# Altium project power.PrjPCB
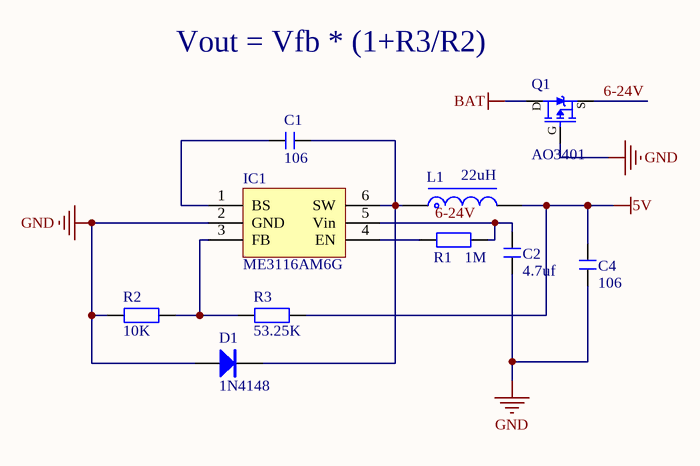
[diagram p0: power.SchDoc]
1 sheet, 10 parts. Net scope: global (net labels, ports and power ports of the same name join across sheets).
Board file: power.PcbDoc

## Sheet power.SchDoc
size A4

### Parts
C1  106  [C 0603_L]
C2  4.7uf  [C 0603_L]
C4  106  [C 0603_L]
D1  1N4148  [SOD-323]
IC1  ME3116AM6G  [SOT23-6N]
L1  22uH  [NR2520]
Q1  AO3401  [SOT23-3L]
R1  1M  [R 0603_L]
R2  10K  [R 0603_L]
R3  53.25K  [R 0603_L]

### Nets
5V: C4.2 L1.2 R3.2
BAT: Q1.3(D)
GND: C2.1 C4.1 D1.1(A) IC1.2(GND) Q1.1(G) R2.1
6-24V: C2.2 IC1.5(Vin) Q1.2(S) R1.2
NetC1_1: C1.1 IC1.1(BS)
NetC1_2: C1.2 D1.2(K) IC1.6(SW) L1.1
NetIC1_3: IC1.3(FB) R2.2 R3.1
NetIC1_4: IC1.4(EN) R1.1

### Notes on the sheet
- (near Q1) Vout = Vfb * (1+R3/R2)

### Library data of the parts
C1 C2 C4 = C: 无极性贴片电容; 版权归属: 源创客; 材质: X7R; BOM名称: 无极性贴片电容; 学习资源: www.ooocke.com
D1 = 1N4148: 高速开关二极管; 版权归属: 源创客; BOM名称: 高速开关二极管; 学习资源: www.ooocke.com
IC1 = SX1308: 可调升压芯片; 版权归属: 源创客; BOM名称: 可调升压芯片; 学习资源: www.ooocke.com
L1 = L-NR: NR磁胶电感; 版权归属: 源创客; BOM名称: NR磁胶电感; 学习资源: www.ooocke.com
Q1 = AO3401: P沟道 30V/4.2A; BOM名称: 场效应管; 版权归属: 源创客; 学习资源: www.ooocke.com; 描述: P沟道 30V/4.2A
R1-R3 = R: 贴片电阻; 版权归属: 源创客; BOM名称: 贴片电阻; 学习资源: www.ooocke.com